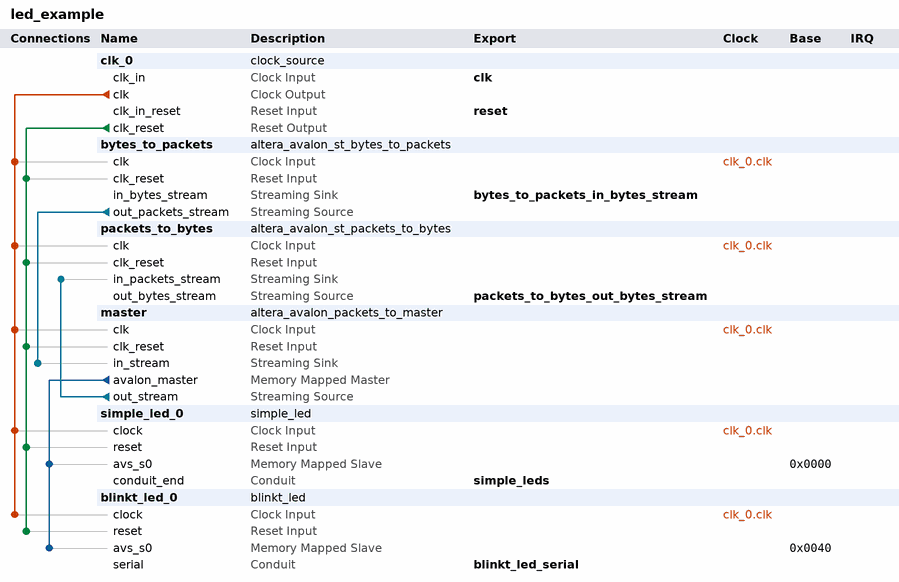
[diagram p0: system contents]
# Platform Designer (Qsys) system led_example, Cyclone 10 LP 10CL025YU256C8G
# Parameters at their usual value, and those the tool derives, are not listed.
package require -exact qsys 18.1
create_system led_example
set_project_property DEVICE_FAMILY {Cyclone 10 LP}
set_project_property DEVICE 10CL025YU256C8G

add_instance clk_0 clock_source 18.1
set_instance_parameter_value clk_0 clockFrequency 50000000

add_instance bytes_to_packets altera_avalon_st_bytes_to_packets 18.1
set_instance_parameter_value bytes_to_packets CHANNEL_WIDTH 8
set_instance_parameter_value bytes_to_packets ENCODING 0

add_instance packets_to_bytes altera_avalon_st_packets_to_bytes 18.1
set_instance_parameter_value packets_to_bytes CHANNEL_WIDTH 8
set_instance_parameter_value packets_to_bytes ENCODING 0

add_instance master altera_avalon_packets_to_master 18.1
set_instance_parameter_value master EXPORT_MASTER_SIGNALS 0
set_instance_parameter_value master FAST_VER 0
set_instance_parameter_value master FIFO_DEPTHS 2

add_instance simple_led_0 simple_led 1.0

add_instance blinkt_led_0 blinkt_led 1.0

# connections
add_connection clk_0.clk blinkt_led_0.clock clock
add_connection clk_0.clk bytes_to_packets.clk clock
add_connection clk_0.clk master.clk clock
add_connection clk_0.clk packets_to_bytes.clk clock
add_connection clk_0.clk simple_led_0.clock clock
add_connection clk_0.clk_reset blinkt_led_0.reset reset
add_connection clk_0.clk_reset bytes_to_packets.clk_reset reset
add_connection clk_0.clk_reset master.clk_reset reset
add_connection clk_0.clk_reset packets_to_bytes.clk_reset reset
add_connection clk_0.clk_reset simple_led_0.reset reset
add_connection master.avalon_master blinkt_led_0.avs_s0 avalon
set_connection_parameter_value master.avalon_master/blinkt_led_0.avs_s0 baseAddress 0x0040
add_connection master.avalon_master simple_led_0.avs_s0 avalon
set_connection_parameter_value master.avalon_master/simple_led_0.avs_s0 baseAddress 0x0000
add_connection bytes_to_packets.out_packets_stream master.in_stream avalon_streaming
add_connection master.out_stream packets_to_bytes.in_packets_stream avalon_streaming

# exported interfaces
add_interface blinkt_led_serial conduit end
set_interface_property blinkt_led_serial EXPORT_OF blinkt_led_0.serial
add_interface bytes_to_packets_in_bytes_stream avalon_streaming sink
set_interface_property bytes_to_packets_in_bytes_stream EXPORT_OF bytes_to_packets.in_bytes_stream
add_interface clk clock sink
set_interface_property clk EXPORT_OF clk_0.clk_in
add_interface packets_to_bytes_out_bytes_stream avalon_streaming source
set_interface_property packets_to_bytes_out_bytes_stream EXPORT_OF packets_to_bytes.out_bytes_stream
add_interface reset reset sink
set_interface_property reset EXPORT_OF clk_0.clk_in_reset
add_interface simple_leds conduit end
set_interface_property simple_leds EXPORT_OF simple_led_0.conduit_end

set_interconnect_requirement {$system} qsys_mm.clockCrossingAdapter HANDSHAKE
set_interconnect_requirement {$system} qsys_mm.enableEccProtection FALSE
set_interconnect_requirement {$system} qsys_mm.insertDefaultSlave FALSE
set_interconnect_requirement {$system} qsys_mm.maxAdditionalLatency 1

save_system led_example.qsys
